# Altium schematic sheet Communication USB - FT232.SchDoc
size A4
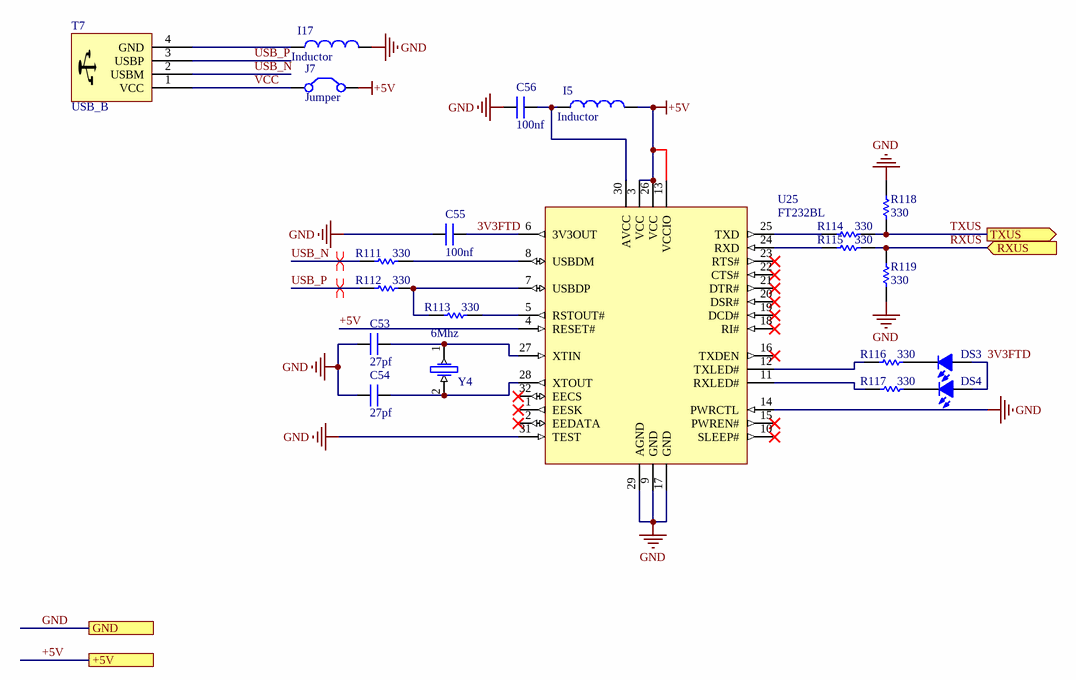
[diagram p0: Communication USB - FT232.SchDoc]

## Parts
C53  27pf  [Cap0805]
C54  27pf  [Cap0805]
C55  100nf  [Cap0805]
C56  100nf  [Cap0805]
DS3  LED  [Led0805]  (value not drawn)
DS4  LED  [Led0805]  (value not drawn)
I5  Inductor  [1206]
I17  Inductor  [1206]
J7  Jumper  [Jumper]
R111  330  [R0805]
R112  330  [R0805]
R113  330  [R0805]
R114  330  [R0805]
R115  330  [R0805]
R116  330  [R0805]
R117  330  [R0805]
R118  330  [R0805]
R119  330  [R0805]
T7  USB_B  [USB_Dip_R]
U25  FT232BL  [LQFP-32_L]
Y4  6Mhz  [CrystallB]

## Ports
+5V, GND, RXUS (in), TXUS (out)

## Nets
+5V: I5.2 J7.2(C2) U25.3(VCC) U25.4(RESET#) U25.13(VCCIO) U25.26(VCC) ; port +5V
GND: C53.1 C54.1 C55.2 C56.2 I17.2 R118.2 R119.1 U25.9(GND) U25.14(PWRCTL) U25.17(GND) U25.29(AGND) U25.31(TEST) ; port GND
3V3FTD: C55.1 DS3.A DS4.A U25.6(3V3OUT)
RXUS: R115.2 R119.2 ; port RXUS
TXUS: R114.2 R118.1 ; port TXUS
USB_N: R111.1 T7.2(USBM)
USB_P: R112.1 T7.3(USBP)
VCC: J7.1(C1) T7.1(VCC)
NetC53_2: C53.2 U25.27(XTIN) Y4.1
NetC54_2: C54.2 U25.28(XTOUT) Y4.2
NetC56_1: C56.1 I5.1 U25.30(AVCC)
NetDS3_K: DS3.K R116.2
NetDS4_K: DS4.K R117.2
NetI17_1: I17.1 T7.4(GND)
NetR111_2: R111.2 U25.8(USBDM)
NetR112_2: R112.2 R113.1 U25.7(USBDP)
NetR113_2: R113.2 U25.5(RSTOUT#)
NetR114_1: R114.1 U25.25(TXD)
NetR115_1: R115.1 U25.24(RXD)
NetR116_1: R116.1 U25.12(TXLED#)
NetR117_1: R117.1 U25.11(RXLED#)

Not connected (* = marked no-connect by the designer): U25 1(EESK)* 2(EEDATA)* 10(SLEEP#)* 15(PWREN#)* 16(TXDEN)* 18(RI#)* 19(DCD#)* 20(DSR#)* 21(DTR#)* 22(CTS#)* 23(RTS#)* 32(EECS)*

## Layout directives
differential pair: USB_N, USB_P

## Notes on the sheet
- Title
- Size:
- Data:
- CompanyName:
- A4
- Number:
- Time:
- Revision:
- Engineer:
- File:

## Library data of the parts
C53-C56 = Cap: Surface mount Capacitor
I5 I17 = Inductor: Indicator
R111-R119 = Resistor
T7 = USB_B: USB B Connector
U25 = FT232BL: USB UART Asynchronous Serial Data Transfer Chip, LQFP-32, Pb-Free; DatasheetVersion: ver 2.2, Nov-2011; PackageVersion: 2010; PackageReference: LQFP-32; PackageDescription: 32-Pin Thin Quad Flat Pack 0.8 mm Pitch; ComponentLink1Description: Manufacturer URL; ComponentLink1URL: http://www.ftdichip.com/; ComponentLink2Description: Datasheet; ComponentLink2URL: http://www.ftdichip.com/Support/Documents/DataSheets/ICs/DS_FT232BL_BQ.pdf
Y4 = Crystal